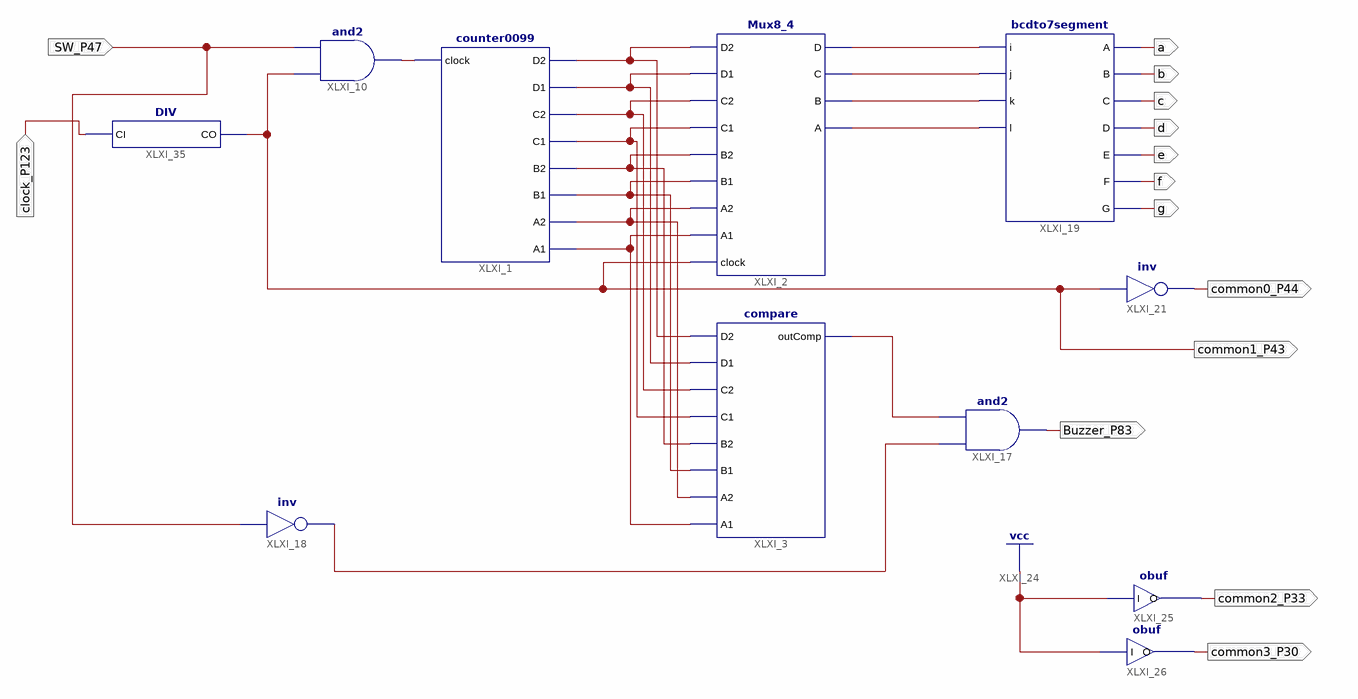
[diagram p0: schematic sheet 1]
// Xilinx ISE schematic Lab6.sch (spartan6) as structural Verilog: 11 symbols, 14 ports
module Lab6 (
  input  SW_P47,
  input  clock_P123,
  output Buzzer_P83,
  output common0_P44,
  output a,
  output b,
  output c,
  output d,
  output e,
  output f,
  output g,
  output common2_P33,
  output common3_P30,
  output common1_P43
);

  wire XLXN_1, XLXN_9, XLXN_10, XLXN_12, XLXN_13, XLXN_14, XLXN_15, XLXN_16, XLXN_17, XLXN_18, XLXN_19,
       XLXN_20, XLXN_21, XLXN_22, XLXN_23;

  counter0099 XLXI_1 (
    .A1(XLXN_19), .A2(XLXN_18), .B1(XLXN_17), .B2(XLXN_16), .C1(XLXN_15), .C2(XLXN_14), .clock(XLXN_1),
    .D1(XLXN_13), .D2(XLXN_12));
  Mux8_4 XLXI_2 (
    .A(XLXN_23), .A1(XLXN_19), .A2(XLXN_18), .B(XLXN_22), .B1(XLXN_17), .B2(XLXN_16), .C(XLXN_21),
    .C1(XLXN_15), .C2(XLXN_14), .clock(common1_P43), .D(XLXN_20), .D1(XLXN_13), .D2(XLXN_12));
  compare XLXI_3 (
    .A1(XLXN_19), .A2(XLXN_18), .B1(XLXN_17), .B2(XLXN_16), .C1(XLXN_15), .C2(XLXN_14), .D1(XLXN_13),
    .D2(XLXN_12), .outComp(XLXN_9));
  and XLXI_10 (XLXN_1, common1_P43, SW_P47);
  and XLXI_17 (Buzzer_P83, XLXN_10, XLXN_9);
  not XLXI_18 (XLXN_10, SW_P47);
  bcdto7segment XLXI_19 (
    .A(a), .B(b), .C(c), .D(d), .E(e), .F(f), .G(g), .i(XLXN_20), .j(XLXN_21), .k(XLXN_22), .l(XLXN_23));
  obuf XLXI_25 (.I(1'b1), .O(common2_P33));
  obuf XLXI_26 (.I(1'b1), .O(common3_P30));
  DIV XLXI_35 (.CI(clock_P123), .CO(common1_P43));
  not XLXI_21 (common0_P44, common1_P43);
endmodule
